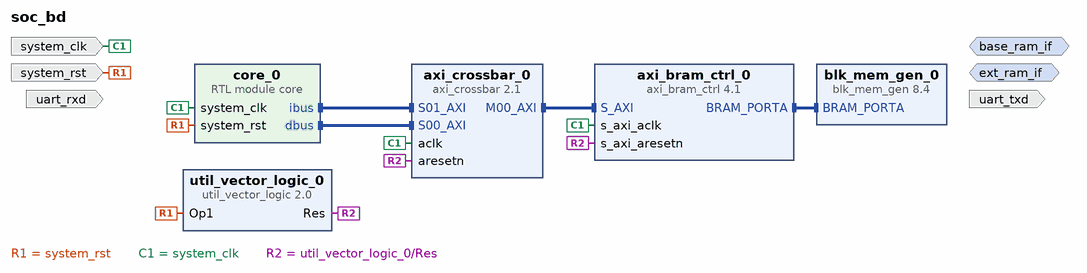
[diagram p0: block diagram of the top level]
# Vivado block design soc_bd, xc7a100tfgg676-2L, Vivado 2018.3
create_bd_design soc_bd

create_bd_intf_port -mode Master -vlnv xilinx.com:interface:emc_rtl:1.0 ext_ram_if
create_bd_intf_port -mode Master -vlnv xilinx.com:interface:emc_rtl:1.0 base_ram_if
create_bd_port -dir I -type rst system_rst
set_property -dict {CONFIG.POLARITY ACTIVE_HIGH} [get_bd_ports system_rst]
create_bd_port -dir I -type clk system_clk
set_property -dict {CONFIG.ASSOCIATED_RESET system_rst} [get_bd_ports system_clk]
create_bd_port -dir I uart_rxd
create_bd_port -dir O uart_txd

create_bd_cell -type ip -vlnv xilinx.com:ip:axi_crossbar:2.1 axi_crossbar_0
set_property -dict [list \
  CONFIG.ID_WIDTH 16 \
  CONFIG.NUM_MI 1 \
  CONFIG.NUM_SI 2 \
  CONFIG.S00_ARB_PRIORITY 2 \
  CONFIG.S01_ARB_PRIORITY 1 \
  CONFIG.S01_BASE_ID 0x00008000 \
  CONFIG.S02_BASE_ID 0x00010000 \
  CONFIG.S03_BASE_ID 0x00018000 \
  CONFIG.S04_BASE_ID 0x00020000 \
  CONFIG.S05_BASE_ID 0x00028000 \
  CONFIG.S06_BASE_ID 0x00030000 \
  CONFIG.S07_BASE_ID 0x00038000 \
  CONFIG.S08_BASE_ID 0x00040000 \
  CONFIG.S09_BASE_ID 0x00048000 \
  CONFIG.S10_BASE_ID 0x00050000 \
  CONFIG.S11_BASE_ID 0x00058000 \
  CONFIG.S12_BASE_ID 0x00060000 \
  CONFIG.S13_BASE_ID 0x00068000 \
  CONFIG.S14_BASE_ID 0x00070000 \
  CONFIG.S15_BASE_ID 0x00078000 \
] [get_bd_cells axi_crossbar_0]
create_bd_cell -type ip -vlnv xilinx.com:ip:util_vector_logic:2.0 util_vector_logic_0
set_property -dict {CONFIG.C_OPERATION not CONFIG.C_SIZE 1} [get_bd_cells util_vector_logic_0]
create_bd_cell -type ip -vlnv xilinx.com:ip:axi_bram_ctrl:4.1 axi_bram_ctrl_0
set_property -dict {CONFIG.READ_LATENCY 1 CONFIG.SINGLE_PORT_BRAM 1} [get_bd_cells axi_bram_ctrl_0]
create_bd_cell -type ip -vlnv xilinx.com:ip:blk_mem_gen:8.4 blk_mem_gen_0
set_property -dict [list \
  CONFIG.Coe_File ../../../../../../../../../../../tmp/main.coe \
  CONFIG.EN_SAFETY_CKT true \
  CONFIG.Enable_32bit_Address true \
  CONFIG.Fill_Remaining_Memory_Locations true \
  CONFIG.Load_Init_File true \
  CONFIG.Memory_Type Single_Port_RAM \
  CONFIG.Port_A_Write_Rate 50 \
  CONFIG.Register_PortA_Output_of_Memory_Primitives true \
  CONFIG.Use_RSTA_Pin true \
  CONFIG.use_bram_block Stand_Alone \
] [get_bd_cells blk_mem_gen_0]
create_bd_cell -type module -reference core core_0

# ---- connections ----

connect_bd_intf_net [get_bd_intf_pins axi_bram_ctrl_0/S_AXI] [get_bd_intf_pins axi_crossbar_0/M00_AXI]
connect_bd_intf_net [get_bd_intf_pins core_0/ibus] [get_bd_intf_pins axi_crossbar_0/S01_AXI]
connect_bd_intf_net [get_bd_intf_pins axi_bram_ctrl_0/BRAM_PORTA] [get_bd_intf_pins blk_mem_gen_0/BRAM_PORTA]
connect_bd_intf_net [get_bd_intf_pins core_0/dbus] [get_bd_intf_pins axi_crossbar_0/S00_AXI]
connect_bd_net -net system_rst_0_1 [get_bd_ports system_rst] [get_bd_pins util_vector_logic_0/Op1] [get_bd_pins core_0/system_rst]
connect_bd_net -net system_clk_0_1 [get_bd_ports system_clk] \
  [get_bd_pins axi_crossbar_0/aclk] [get_bd_pins axi_bram_ctrl_0/s_axi_aclk] [get_bd_pins core_0/system_clk]
connect_bd_net [get_bd_pins util_vector_logic_0/Res] [get_bd_pins axi_crossbar_0/aresetn] [get_bd_pins axi_bram_ctrl_0/s_axi_aresetn]

# ---- address map ----
assign_bd_address -offset 0x80000000 -range 64K -target_address_space [get_bd_addr_spaces core_0/dbus] [get_bd_addr_segs axi_bram_ctrl_0/S_AXI/Mem0]
assign_bd_address -offset 0x80000000 -range 64K -target_address_space [get_bd_addr_spaces core_0/ibus] [get_bd_addr_segs axi_bram_ctrl_0/S_AXI/Mem0]

validate_bd_design
save_bd_design
